# EAGLE design Steering Wheel V2.2 (EAGLE 7.2.0)
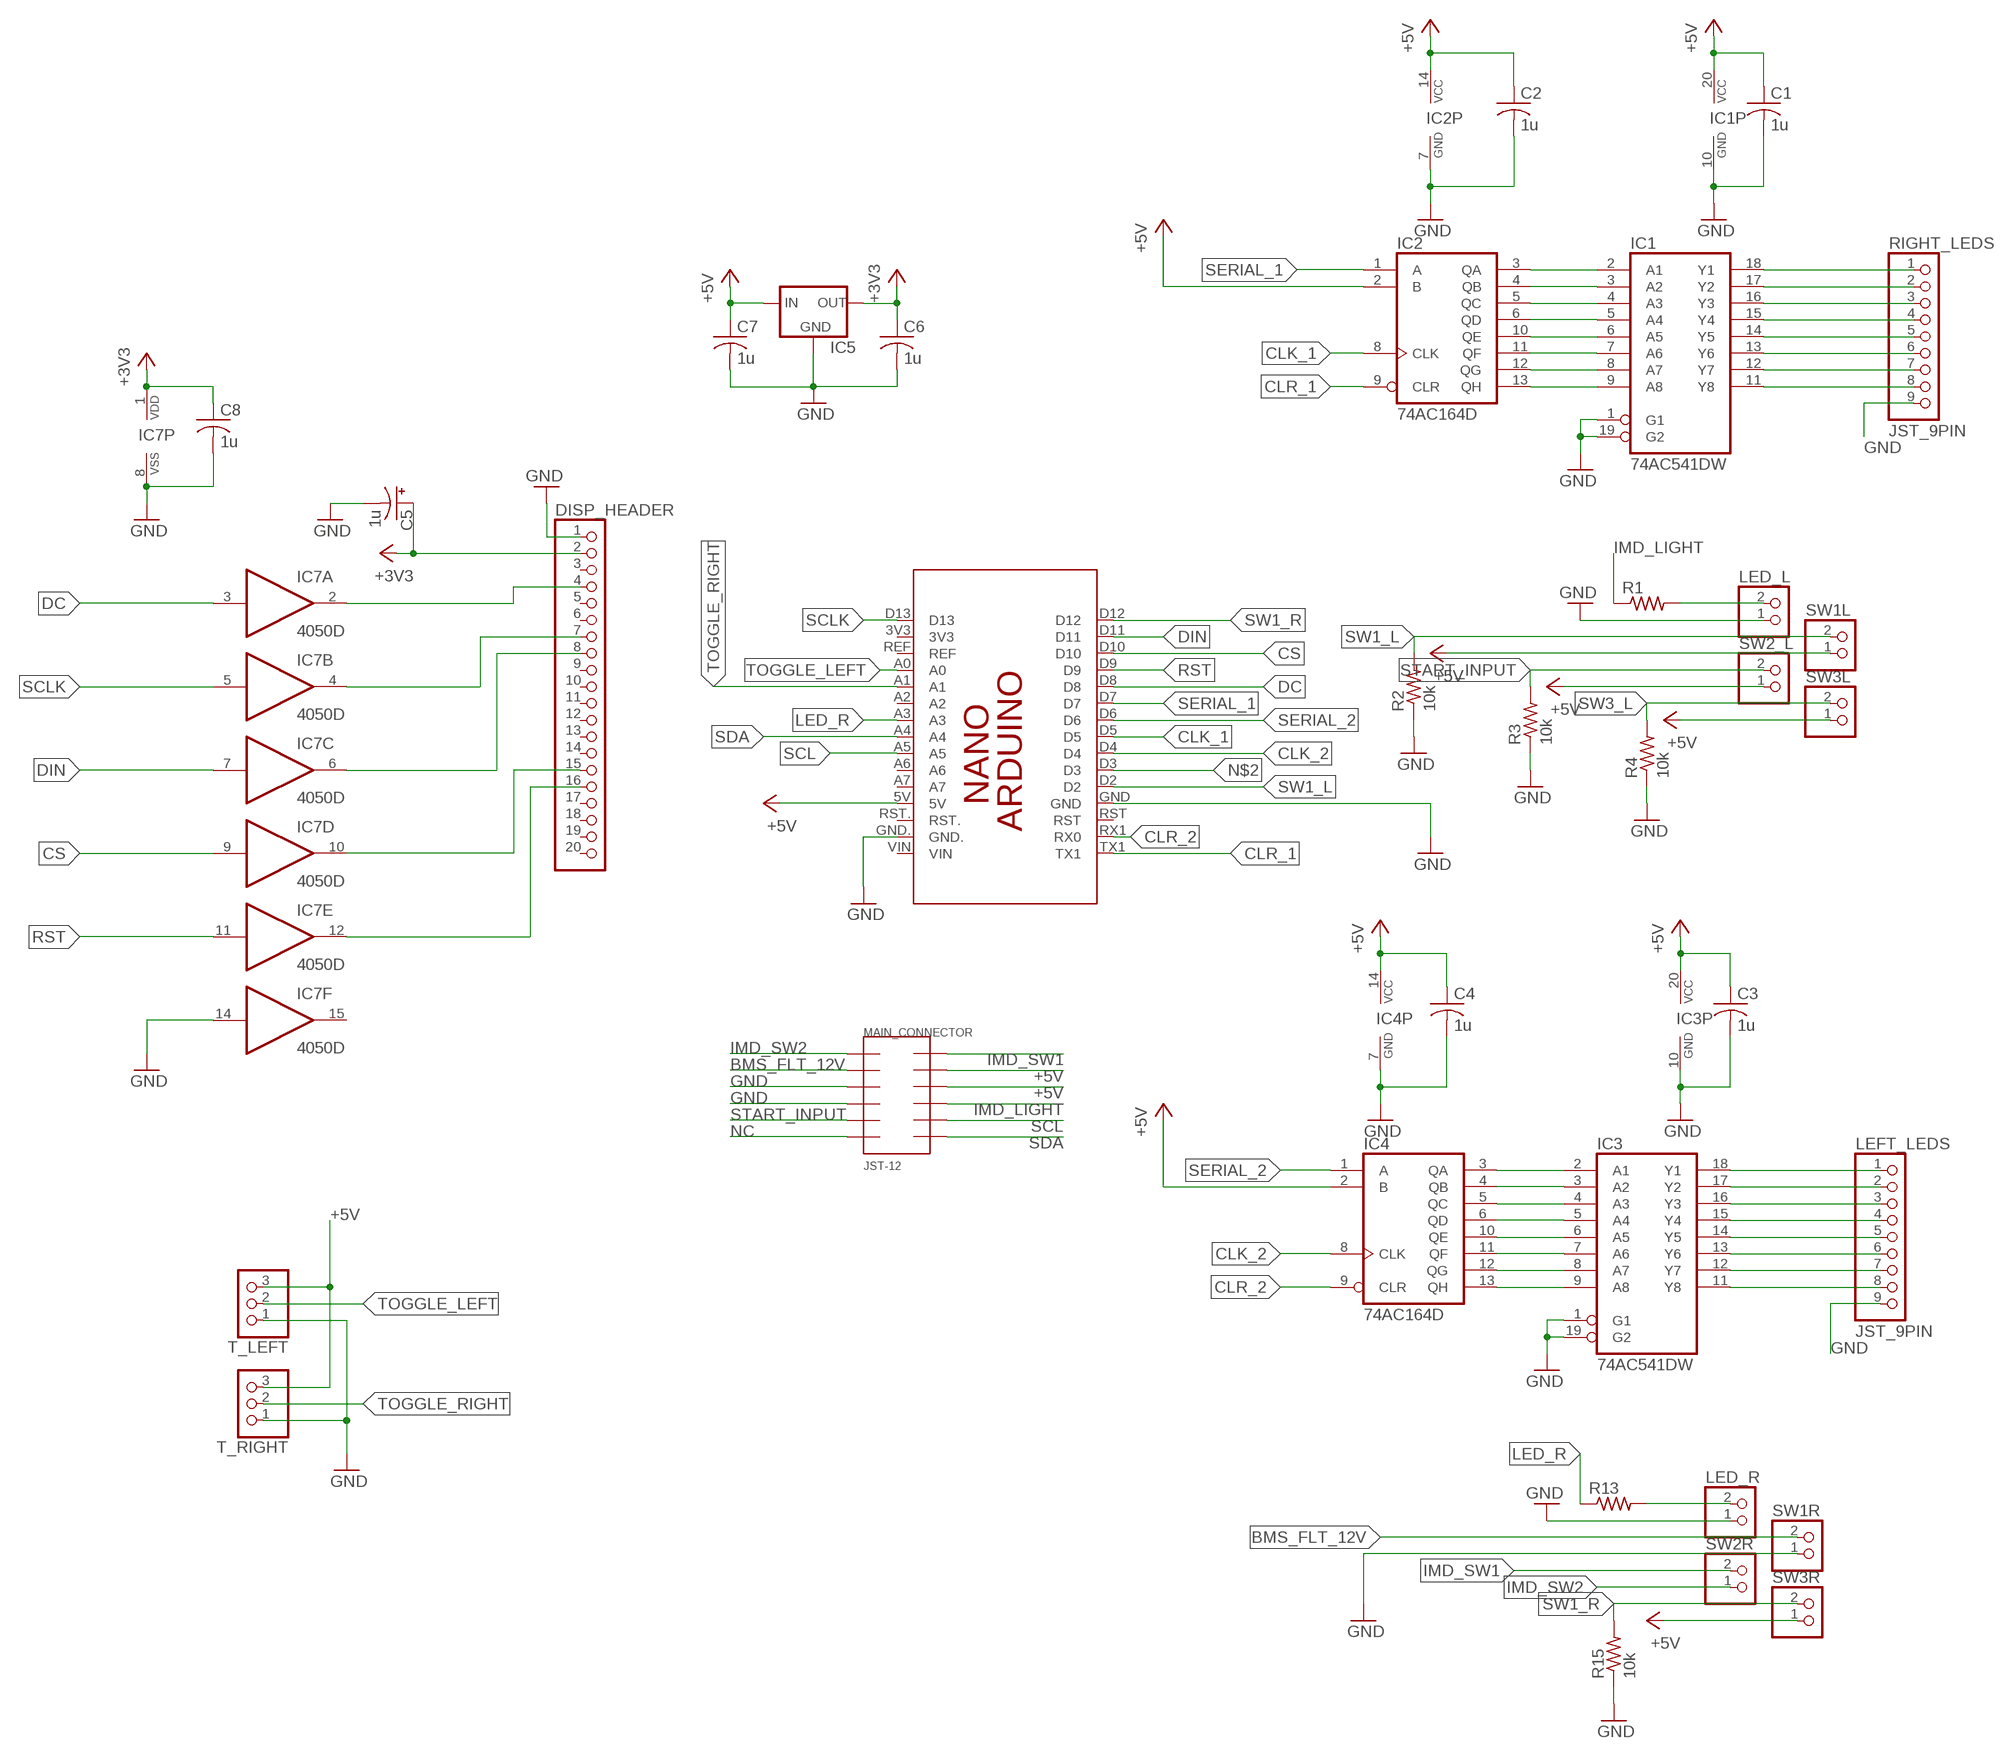
[diagram p0: schematic, sheet 1]

## Parts
C1  1u  C-USC1206  [C1206]
C2  1u  C-USC1206  [C1206]
C3  1u  C-USC1206  [C1206]
C4  1u  C-USC1206  [C1206]
C5  1u  CPOL-USE3.5-8  [E3,5-8]
C6  1u  C-USC1206  [C1206]
C7  1u  C-USC1206  [C1206]
C8  1u  C-USC1206  [C1206]
DISP_HEADER  PINHD-1X20  [1X20]
IC1  74AC541DW  [SO20W]
IC2  74AC164D  [SO14]
IC3  74AC541DW  [SO20W]
IC4  74AC164D  [SO14]
IC5  78XXL  [78XXL]
IC7  4050D  [SO16]
LED_L  JST_2PIN-THM  [JST-PH-2-THM]
LED_R  JST_2PIN-THM  [JST-PH-2-THM]
LEFT_LEDS  JST_9PIN  [JST-PH-9-THM]
MAIN_CONNECTOR  JST-12  [PHD-12]
PCB1  ARDUINO_NANO  [ARDUINO_NANO]
R1  R-US_M1206  [M1206]
R2  10k  R-US_M1206  [M1206]
R3  10k  R-US_M1206  [M1206]
R4  10k  R-US_M1206  [M1206]
R13  R-US_M1206  [M1206]
R15  10k  R-US_M1206  [M1206]
RIGHT_LEDS  JST_9PIN  [JST-PH-9-THM]
SW1L  JST_2PIN-THM  [JST-PH-2-THM]
SW1R  JST_2PIN-THM  [JST-PH-2-THM]
SW2_L  JST_2PIN-THM  [JST-PH-2-THM]
SW2R  JST_2PIN-THM  [JST-PH-2-THM]
SW3L  JST_2PIN-THM  [JST-PH-2-THM]
SW3R  JST_2PIN-THM  [JST-PH-2-THM]
T_LEFT  JST_3PIN  [JST-PH-3-THM]
T_RIGHT  JST_3PIN  [JST-PH-3-THM]

## Nets
+3V3: C5.+ C6.1 C8.1 DISP_HEADER.2 IC5.OUT IC7.1(P:VDD)
+5V: C1.1 C2.1 C3.1 C4.1 C7.1 IC1.20(VCC) IC2.2(B) IC2.14(VCC) IC3.20(VCC) IC4.2(B) IC4.14(VCC) IC5.IN MAIN_CONNECTOR.10 MAIN_CONNECTOR.11 PCB1.5V SW1L.1 SW2_L.1 SW3L.1 SW3R.1 T_LEFT.3 T_RIGHT.3
BMS_FLT_12V: MAIN_CONNECTOR.2 SW1R.2
CLK_1: IC2.8(CLK) PCB1.D5
CLK_2: IC4.8(CLK) PCB1.D4
CLR_1: IC2.9(CLR) PCB1.TX1
CLR_2: IC4.9(CLR) PCB1.RX1(RX0)
CS: IC7.9(D:I) PCB1.D10
DC: IC7.3(A:I) PCB1.D8
DIN: IC7.7(C:I) PCB1.D11
GND: C1.2 C2.2 C3.2 C4.2 C5.- C6.2 C7.2 C8.2 DISP_HEADER.1 IC1.1(G1) IC1.10(GND) IC1.19(G2) IC2.7(GND) IC3.1(G1) IC3.10(GND) IC3.19(G2) IC4.7(GND) IC5.GND IC7.8(P:VSS) IC7.14(F:I) LED_L.1 LED_R.1 LEFT_LEDS.9 MAIN_CONNECTOR.3 MAIN_CONNECTOR.4 PCB1.GND PCB1.GND. R2.1 R3.1 R4.1 R15.1 RIGHT_LEDS.9 SW1R.1 T_LEFT.1 T_RIGHT.1
IMD_LIGHT: MAIN_CONNECTOR.9 R1.1
IMD_SW1: MAIN_CONNECTOR.12 SW2R.2
IMD_SW2: MAIN_CONNECTOR.1 SW2R.1
LED_R: PCB1.A3 R13.1
LED_RIGHT: LED_R.2 R13.2
N$1: LED_L.2 R1.2
N$2: PCB1.D3
N$10: IC1.13(Y6) RIGHT_LEDS.6
N$14: IC1.15(Y4) RIGHT_LEDS.4
N$15: IC1.14(Y5) RIGHT_LEDS.5
N$16: IC1.12(Y7) RIGHT_LEDS.7
N$17: IC1.11(Y8) RIGHT_LEDS.8
N$18: IC1.9(A8) IC2.13(QH)
N$19: IC1.2(A1) IC2.3(QA)
N$20: IC1.3(A2) IC2.4(QB)
N$21: IC1.4(A3) IC2.5(QC)
N$22: IC1.5(A4) IC2.6(QD)
N$23: IC1.6(A5) IC2.10(QE)
N$24: IC1.7(A6) IC2.11(QF)
N$25: IC1.8(A7) IC2.12(QG)
N$35: IC3.18(Y1) LEFT_LEDS.1
N$36: IC3.17(Y2) LEFT_LEDS.2
N$37: IC3.16(Y3) LEFT_LEDS.3
N$38: IC3.15(Y4) LEFT_LEDS.4
N$39: IC3.14(Y5) LEFT_LEDS.5
N$40: IC3.13(Y6) LEFT_LEDS.6
N$41: IC3.12(Y7) LEFT_LEDS.7
N$42: IC3.11(Y8) LEFT_LEDS.8
N$43: IC3.9(A8) IC4.13(QH)
N$44: IC3.2(A1) IC4.3(QA)
N$45: IC3.3(A2) IC4.4(QB)
N$46: IC3.4(A3) IC4.5(QC)
N$47: IC3.5(A4) IC4.6(QD)
N$48: IC3.6(A5) IC4.10(QE)
N$49: IC3.7(A6) IC4.11(QF)
N$50: IC3.8(A7) IC4.12(QG)
N$51: DISP_HEADER.4 IC7.2(A:O)
N$52: DISP_HEADER.16 IC7.12(E:O)
N$53: DISP_HEADER.15 IC7.10(D:O)
N$54: IC1.18(Y1) RIGHT_LEDS.1
N$55: IC1.17(Y2) RIGHT_LEDS.2
N$56: IC1.16(Y3) RIGHT_LEDS.3
N$59: DISP_HEADER.7 IC7.4(B:O)
N$67: DISP_HEADER.8 IC7.6(C:O)
NC: MAIN_CONNECTOR.6
RST: IC7.11(E:I) PCB1.D9
SCL: MAIN_CONNECTOR.8 PCB1.A5
SCLK: IC7.5(B:I) PCB1.D13
SDA: MAIN_CONNECTOR.7 PCB1.A4
SERIAL_1: IC2.1(A) PCB1.D7
SERIAL_2: IC4.1(A) PCB1.D6
START_INPUT: MAIN_CONNECTOR.5 R3.2 SW2_L.2
SW1_L: PCB1.D2 R2.2 SW1L.2
SW1_R: PCB1.D12 R15.2 SW3R.2
SW3_L: R4.2 SW3L.2
TOGGLE_LEFT: PCB1.A0 T_LEFT.2
TOGGLE_RIGHT: PCB1.A1 T_RIGHT.2
Unconnected: DISP_HEADER.3 DISP_HEADER.5 DISP_HEADER.6 DISP_HEADER.9 DISP_HEADER.10 DISP_HEADER.11 DISP_HEADER.12 DISP_HEADER.13 DISP_HEADER.14 DISP_HEADER.17 DISP_HEADER.18 DISP_HEADER.19 DISP_HEADER.20 IC7.15(F:O) PCB1.3V3 PCB1.A2 PCB1.A6 PCB1.A7 PCB1.REF PCB1.RST PCB1.RST. PCB1.VIN

## Library data of the parts
C1-C4 C6-C8 = adafruit:C-US: CAPACITOR, American symbol
C5 = adafruit:CPOL-US: POLARIZED CAPACITOR, American symbol
DISP_HEADER = adafruit:PINHD-1X20: PIN HEADER
IC1 IC3 = 74xx-eu:74*541: Octal BUFFER and LINE DRIVER, 3-state
IC2 IC4 = 74xx-eu:74*164: 8-bit parallel out SHIFT REGISTER
IC5 = v-reg:78XXL: VOLTAGE REGULATOR
IC7 = 40xx:4050: Hex non-inverting BUFFER
LED_L LED_R SW1L SW1R SW2_L SW2R SW3L SW3R = adafruit:JST_2PIN: JST 2-Pin Connectors of various flavors SMT-RA (S2B-PH-SM4) 4UConnector #17311 SMT (B2B-PH-SM4) THM-RA (S2B-PH) THM (B2B-PH)
LEFT_LEDS RIGHT_LEDS = adafruit:JST_9PIN
MAIN_CONNECTOR = JST:JST-12
PCB1 = E14_Arduino_revB:ARDUINO_NANO: Device for representing an Arduino Nano board with a footprint in an EAGLE design. Created by Dave Young for Element14. More EAGLE documentation at: http://www.element14.com/community/community/knode/cadsoft_eagle
R1-R4 R13 R15 = adafruit:R-US_: RESISTOR, American symbol
T_LEFT T_RIGHT = adafruit:JST_3PIN

## Board
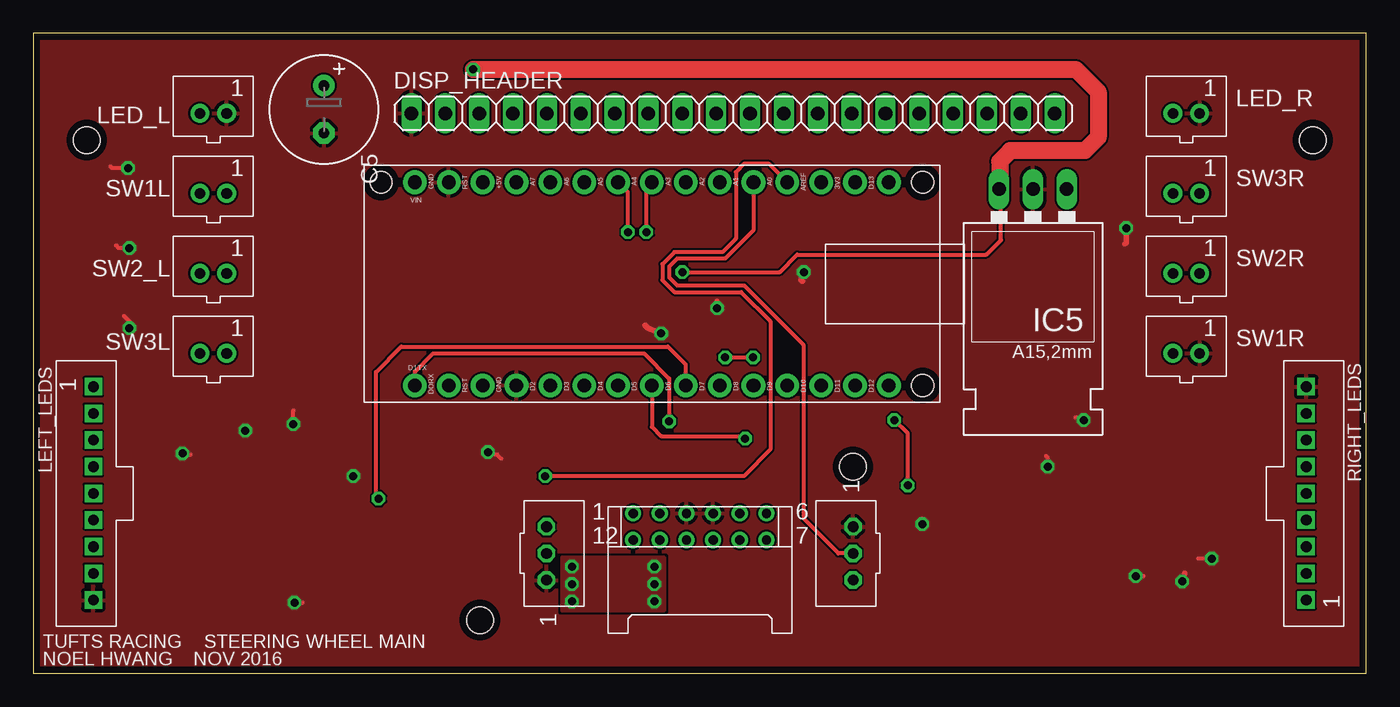
[diagram p1: board, top side]
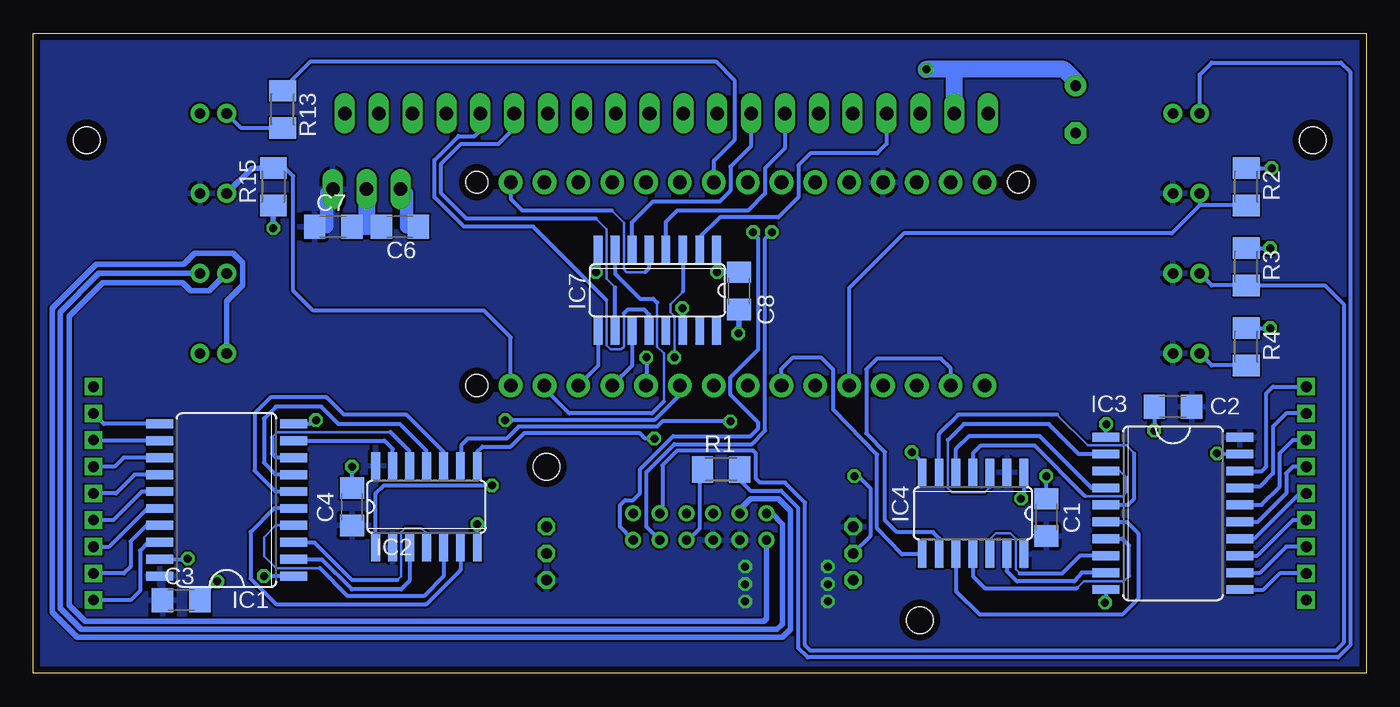
[diagram p2: board, bottom side, seen from below]

Size 100 x 48 mm. Coordinates in mm from the lower left corner, seen from the top.
Outline: 0,0 100,0 100,48 0,48 0,0
Copper layers (1*16): Top 0.035mm / dielectric 1.5mm / Bottom 0.035mm
Design rules: minimum track width 6mil, minimum drill 8mil, track to track 6mil, track to pad 6mil, pad to pad 6mil, via to via 6mil, smd to smd 6mil, copper to edge 20mil, drill to drill 6mil, minimum pad ring 10mil, minimum via ring 8mil, stop-mask expansion 4mil, vias tented up to drill 0mil, thermal gap 10mil
Holes 2 mm at 4,40 96,40 61.5,15.5 33.5,4

### Footprints (pad centres in the part's own frame; a part is rotated, then mirrored left to right if it is on the bottom)
C1206 = smd 1.6 x 1.8: 1 -1.4,0; 2 1.4,0
E3,5-8 = drill 0.813 pad 1.6: + -1.778,0 | drill 0.813 pad 1.6 octagon: - 1.778,0
1X20 = drill 1.016 long: 1 -24.13,0; 2 -21.59,0; 3 -19.05,0; 4 -16.51,0; 5 -13.97,0; 6 -11.43,0; 7 -8.89,0; 8 -6.35,0; 9 -3.81,0; 10 -1.27,0; 11 1.27,0; 12 3.81,0; 13 6.35,0; 14 8.89,0; 15 11.43,0; 16 13.97,0; 17 16.51,0; 18 19.05,0; 19 21.59,0; 20 24.13,0
SO20W = smd 0.66 x 2.032: 1 -5.715,-5.029; 2 -4.445,-5.029; 3 -3.175,-5.029; 4 -1.905,-5.029; 5 -0.635,-5.029; 6 0.635,-5.029; 7 1.905,-5.029; 8 3.175,-5.029; 9 4.445,-5.029; 10 5.715,-5.029; 11 5.715,5.029; 12 4.445,5.029; 13 3.175,5.029; 14 1.905,5.029; 15 0.635,5.029; 16 -0.635,5.029; 17 -1.905,5.029; 18 -3.175,5.029; 19 -4.445,5.029; 20 -5.715,5.029
SO14 = smd 0.66 x 2.032: 1 -3.81,-3.073; 2 -2.54,-3.073; 3 -1.27,-3.073; 4 0,-3.073; 5 1.27,-3.073; 6 2.54,-3.073; 7 3.81,-3.073; 8 3.81,3.073; 9 2.54,3.073; 10 1.27,3.073; 11 0,3.073; 12 -1.27,3.073; 13 -2.54,3.073; 14 -3.81,3.073
78XXL = drill 1.016 long: GND 0,-3.81; IN -2.54,-3.81; OUT 2.54,-3.81
SO16 = smd 0.66 x 2.032: 1 -4.445,-3.073; 2 -3.175,-3.073; 3 -1.905,-3.073; 4 -0.635,-3.073; 5 0.635,-3.073; 6 1.905,-3.073; 7 3.175,-3.073; 8 4.445,-3.073; 9 4.445,3.073; 10 3.175,3.073; 11 1.905,3.073; 12 0.635,3.073; 13 -0.635,3.073; 14 -1.905,3.073; 15 -3.175,3.073; 16 -4.445,3.073
JST-PH-2-THM = drill 0.8 pad 1.422: 1 1,0; 2 -1,0
JST-PH-9-THM = drill 0.8 square: 1 8,0; 2 6,0; 3 4,0; 4 2,0; 5 0,0; 6 -2,0; 7 -4,0; 8 -6,0; 9 -8,0
PHD-12 = drill 0.7: 1 -5,1; 2 -3,1; 3 -1,1; 4 1,1; 5 3,1; 6 5,1; 7 5,-1; 8 3,-1; 9 1,-1; 10 -1,-1; 11 -3,-1; 12 -5,-1
ARDUINO_NANO = drill 1.016 pad 1.778: 3V3 6.35,1.27; 5V 31.75,1.27; A0 11.43,1.27; A1 13.97,1.27; A2 16.51,1.27; A3 19.05,1.27; A4 21.59,1.27; A5 24.13,1.27; A6 26.67,1.27; A7 29.21,1.27; D2 29.21,16.51; D3 26.67,16.51; D4 24.13,16.51; D5 21.59,16.51; D6 19.05,16.51; D7 16.51,16.51; D8 13.97,16.51; D9 11.43,16.51; D10 8.89,16.51; D11 6.35,16.51; D12 3.81,16.51; D13 3.81,1.27; GND 31.75,16.51; GND. 36.83,1.27; REF 8.89,1.27; RST 34.29,16.51; RST. 34.29,1.27; RX1 36.83,16.51; TX1 39.37,16.51; VIN 39.37,1.27 | hole 1.651: 1.27,1.27; 1.27,16.51; 41.91,1.27
M1206 = smd 1.6 x 2: 1 -1.4,0; 2 1.4,0
JST-PH-3-THM = drill 0.8 octagon: 1 2,0; 2 0,0; 3 -2,0

### Placement (x,y rotation side)
C1  24,11.7 90 bottom
C2  14.5,20 180 bottom
C3  88.9,5.5 0 bottom
C4  76.1,12.5 90 bottom
C5  21.8,42.3 270 top
C6  72.5,33.5 180 bottom
C7  77.5,33.5 0 bottom
C8  47.06,28.68 270 bottom
DISP_HEADER  52.5,42 0 top
IC1  85.5,13 90 bottom
IC2  70.5,12.5 0 bottom
IC3  14.5,12 270 bottom
IC4  29.5,12 180 bottom
IC5  75,32.5 180 top
IC7  53.18,28.73 180 bottom
LED_L  13.5,42 0 top
LED_R  86.5,42 0 top
LEFT_LEDS  4.5,13.5 90 top
MAIN_CONNECTOR  50,11 0 top
PCB1  68,38.1 180 top
R1  48.4,15.3 0 bottom
R2  9,36.5 270 bottom
R3  9,30.5 270 bottom
R4  9,24.5 270 bottom
R13  81.3,42.3 270 bottom
R15  82,36.5 90 bottom
RIGHT_LEDS  95.5,13.5 270 top
SW1L  13.5,36 0 top
SW1R  86.5,24 0 top
SW2_L  13.5,30 0 top
SW2R  86.5,30 0 top
SW3L  13.5,24 0 top
SW3R  86.5,36 0 top
T_LEFT  38.5,9 270 top
T_RIGHT  61.5,9 90 top

### Tracks (layer width: path | path; a pad name or v marks a point on that pad's centre or on a via)
+3V3  (via drill 0.6)
  Top 0.3: v48.7,30.1 56,30.1 57.3,31.4 71.5,31.4 72.6,32.5 72.6,36.17 IC5.OUT
  Top 1.27: v33,45.3 78.2,45.3 79.9,43.6 79.9,40.2 78.9,39.2 73.3,39.2 72.5,38.4 72.5,36.35 IC5.OUT
  Bottom 0.3: IC7.1 48.73,30.14 v48.7,30.1 48.68,30.08 C8.1
  Bottom 1.016: C6.1 72,33.5 72,36 72.46,36 IC5.OUT
  Bottom 1.27: C5.+ 21.8,44.4 22.7,45.3 31,45.3 | 31,45.3 v33,45.3 | DISP_HEADER.2 30.91,45.21 31,45.3
+5V  (via drill 0.6)
  Bottom 1.016: C7.1 78,33.5 78,36 77.54,36 IC5.IN
  other vias: 40.4,8 40.4,6.7 46.6,8 46.6,6.7 46.6,5.4 40.4,5.4
  pour Bottom (rank 2): -3.5,50 -3.5,-1 104.5,-1 104.5,50
  pour Top: 39.7,8.7 47.3,8.7 47.3,4.7 39.7,4.7
BMS_FLT_12V
  Bottom 0.406: SW1R.2 85.5,27.9 84.3,29.1 84.3,30.8 85,31.5 87.9,31.5 88.7,30.7 95.3,30.7 98.6,27.4 98.6,4.6 96.7,2.7 43.8,2.7 43.2,3.3 43.2,12.2 44.1,13.1 46.2,13.1 47,12.3 MAIN_CONNECTOR.2
CLK_1  (via drill 0.6)
  Top 0.3: PCB1.D5 46.41,18.49 47.1,17.8 53.2,17.8 v53.4,17.6
  Bottom 0.3: v53.4,17.6 54.1,17.6 54.5,18 63.2,18 64.2,17 66.3,17 66.69,16.61 IC2.8
CLK_2
  Bottom 0.3: IC4.8 34.83,8.93 36.7,10.9 36.7,16.4 40,19.8 40,22.8 40.9,23.7 43,23.7 43.87,22.83 PCB1.D4
CLR_1  (via drill 0.6)
  Top 0.3: PCB1.TX1 28.63,22.63 30,24 45.8,24 47.7,22.1 v47.7,18.9
  Bottom 0.3: v47.7,18.9 52.8,18.9 53.2,18.5 63.6,18.5 64.5,17.6 67.4,17.6 67.9,17.1 67.9,15.63 IC2.9
CLR_2
  Bottom 0.3: IC4.9 32.04,10.14 32.5,10.6 35.2,10.6 36.1,11.5 36.1,16.6 37.5,18 37.5,22.8 36.7,23.6 31.9,23.6 31.17,22.87 PCB1.RX1
CS
  Bottom 0.3: IC7.9 57.62,23.07 PCB1.D10
DC  (via drill 0.6)
  Top 0.3: v51.9,23.7 v54,23.7
  Bottom 0.2: 51.27,28.62 52.2,27.7 52.2,27.1 51.9,26.8 v51.9,23.7
  Bottom 0.3: 54.03,21.07 PCB1.D8 54,21.62 v54,23.7 | IC7.3 51.27,28.62
DIN
  Bottom 0.2: 52.7,20.4 52.7,24 53.2,24.5 53.2,27.8
  Bottom 0.3: 52.7,20.4 53.6,19.5 59.8,19.5 61.65,21.35 PCB1.D11 | IC7.7 56.35,29.95 54.5,28.1 53.5,28.1 53.2,27.8
GND  (via drill 0.6)
  Top 0.3: v19.6,5.3 20.2,5.3 | v34.1,16.6 34.8,16.4 35.1,16.1 | v24,14.8 24.2,14.8 24.4,14.7 | v88.4,8.6 87.4,8.6 | v82.7,7.3 83.3,7.3 | v76.1,15.5 76.1,16.2 76,16.3 | v66.7,11.2 66.7,11.6 | v78.8,19 78.2,19.2 | v11.2,16.5 11.8,16.4 | v15.9,18.2 15.9,18.3 15.8,18.2 | v19.5,18.7 19.5,19.7 | v7.2,25.9 7.2,26.4 6.8,26.8 | v7.2,31.9 6.4,31.9 6.2,32.1 | v7.1,37.9 5.9,37.9 5.8,38
  Top 0.406: v82,33.4 82,32.3 81.9,32.2 | v86.2,6.9 86.4,7.5 | v51.3,27.4 51.3,27.9 | v47.1,25.5 46.1,25.9 45.9,26.1 | v57.8,30.1 57.6,29.5 57.7,29.4
  Bottom 0.3: IC3.10 19.53,5.37 v19.6,5.3 | IC4.7 33.31,15.81 v34.1,16.6 | C1.2 v24,14.8 | IC1.19 88.44,8.55 v88.4,8.6 | IC1.1 82.69,7.29 v82.7,7.3 82.8,7.2 | C4.2 v76.1,15.5 | IC2.7 v66.69,11.19 v66.7,11.2 | IC1.10 79.28,18.71 v78.8,19 | IC3.19 10.96,16.45 v11.2,16.5 | C2.2 v15.9,18.2 | IC3.1 19.53,18.57 v19.5,18.7 | R4.1 v7.2,25.9 | R3.1 v7.2,31.9 | R2.1 v7.1,37.9 | 87.5,5.7 v86.2,6.9
  Bottom 0.406: R15.1 v82,33.4 | C3.2 87.5,5.7 | IC7.14 51.27,27.38 v51.3,27.4 | C8.2 47.06,25.94 v47.1,25.5 | IC7.8 57.62,30.32 v57.8,30.1
  Bottom 1.27: C6.2 75.2,33.5 | 75.2,33.5 C7.2 | IC5.GND 75,33.7 75.2,33.5
  pour Top (rank 2): -4.1,49.4 103.9,49.4 103.9,-3.1 -4.1,-3.1
IMD_LIGHT
  Bottom 0.3: MAIN_CONNECTOR.9 50.9,10 50,10.9 50,15.1 R1.1
IMD_SW1
  Bottom 0.406: MAIN_CONNECTOR.12 45,4.1 45.2,3.9 96.1,3.9 97.3,5.1 97.3,26.8 94.8,29.3 88.8,29.3 88.2,28.7 86.8,28.7 SW2R.2
IMD_SW2
  Bottom 0.406: MAIN_CONNECTOR.1 44.6,12 43.8,11.2 43.8,3.7 44.2,3.3 96.4,3.3 98,4.9 98,27.1 95.1,30 SW2R.1
LED_R
  Bottom 0.3: R13.1 81.3,43.8 79.2,45.9 48.8,45.9 47.4,44.5 47.4,40 48.95,38.45 PCB1.A3
LED_RIGHT
  Bottom 0.3: R13.2 84.4,40.9 LED_R.2
N$1
  Bottom 0.3: LED_L.2 12.5,44.9 11.6,45.8 1.9,45.8 1.2,45.1 1.2,2.1 2.1,1.2 41.9,1.2 42.6,1.9 42.6,12.4 43.9,13.7 46.2,13.7 47,14.5 R1.2
N$10
  Bottom 0.3: IC1.13 93.22,16.18 93.9,15.5 RIGHT_LEDS.6
N$14
  Bottom 0.3: IC1.15 91.86,13.63 94,11.5 RIGHT_LEDS.4
N$15
  Bottom 0.3: IC1.14 92.39,14.9 93.8,13.5 RIGHT_LEDS.5
N$16
  Bottom 0.3: IC1.12 95.44,17.45 RIGHT_LEDS.7
N$17
  Bottom 0.3: IC1.11 94.72,18.71 RIGHT_LEDS.8
N$18
  Bottom 0.3: IC2.13 73.04,16.84 73.64,17.45 IC1.9
N$19
  Bottom 0.3: IC2.3 71.77,6.93 72.4,6.3 76.1,6.3 78.36,8.55 IC1.2
N$20
  Bottom 0.2: 70.5,10.5 70.9,10.9 72.1,10.9 72.4,10.6 72.4,7.3 72.7,7
  Bottom 0.3: IC2.4 70.5,10.5 | 72.7,7 76.1,7 78.92,9.82 IC1.3
N$21
  Bottom 0.2: 78.5,7.9 81.8,7.9 82.7,8.8 82.7,10.2 81.81,11.1 IC1.4
  Bottom 0.3: IC2.5 69.23,7.27 70.7,5.8 76.4,5.8 78.5,7.9
N$22
  Bottom 0.3: IC1.5 81.94,12.37 83.7,10.6 83.7,7.1 81.8,5.2 70.5,5.2 67.96,7.74 IC2.6
N$23
  Bottom 0.3: IC2.10 69.23,16.63 72,19.4 76.7,19.4 78,20.7 82.2,20.7 83.4,19.5 83.4,15.2 81.83,13.63 IC1.6
N$24
  Bottom 0.3: IC2.11 70.5,16.7 72.5,18.7 77.1,18.7 78.4,20 81.8,20 82.7,19.1 82.7,15.8 81.81,14.9 IC1.7
N$25
  Bottom 0.2: 73.2,18.1 81.7,18.1 82.1,17.7
  Bottom 0.3: IC2.12 71.77,16.67 73.2,18.1 | 82.1,17.7 82.1,16.5 81.78,16.18 IC1.8
N$35
  Bottom 0.3: IC3.18 7.83,15.18 7.5,15.5 7.5,21 7,21.5 LEFT_LEDS.1
N$36
  Bottom 0.3: LEFT_LEDS.2 6,19.5 7,18.5 7,15 8,14 9.38,14 IC3.17
N$37
  Bottom 0.3: LEFT_LEDS.3 5.5,17.5 6.5,16.5 6.5,14 7.87,12.63 IC3.16
N$38
  Bottom 0.3: LEFT_LEDS.4 5.5,15.5 6,15 6,13.5 8.13,11.37 IC3.15
N$39
  Bottom 0.3: LEFT_LEDS.5 5,13.5 8.4,10.1 IC3.14
N$40
  Bottom 0.3: LEFT_LEDS.6 5.5,11.5 8.18,8.82 IC3.13
N$41
  Bottom 0.3: LEFT_LEDS.7 6,9.5 7.95,7.55 IC3.12
N$42
  Bottom 0.3: LEFT_LEDS.8 6.5,7.5 7.71,6.29 IC3.11
N$43
  Bottom 0.3: IC3.9 21.34,7.55 21.9,6.9 26.2,6.9 26.96,7.66 IC4.13
N$44
  Bottom 0.2: 28.23,13.97 28.6,13.6 31.1,13.6 31.4,13.9 31.4,17.5
  Bottom 0.3: IC4.3 28.23,13.97 | IC3.2 21.55,16.45 23.8,18.7 30.2,18.7 31.4,17.5
N$45
  Bottom 0.2: IC3.3 18.48,15.18 18,14.7 18,13.6 18.3,13.3 21.1,13.3
  Bottom 0.3: 21.1,13.3 24.9,17.1 28.9,17.1 29.5,16.5 IC4.4
N$46
  Bottom 0.3: IC3.4 20.61,13.9 24.5,17.8 29.8,17.8 30.77,16.83 IC4.5
N$47
  Bottom 0.2: 17.4,16.5 18,17.1 20.9,17.1 23.2,19.4
  Bottom 0.3: IC3.5 17.86,12.63 17.4,13.1 17.4,16.5 | IC4.6 32.04,17.96 30.6,19.4 23.2,19.4
N$48
  Bottom 0.3: IC3.6 17.96,11.37 17.1,10.5 17.1,5.6 18.3,4.4 29,4.4 30.77,6.17 IC4.10
N$49
  Bottom 0.2: 21.7,6.4 21.2,6.9 18.2,6.9 17.8,7.3
  Bottom 0.3: IC4.11 29.5,7.3 28.6,6.4 21.7,6.4 | 17.8,7.3 17.8,9.6 18.3,10.1 IC3.7
N$50
  Bottom 0.2: IC4.12 28.23,10.07 27.8,10.5 26.7,10.5 26.3,10.1 26.3,7.8 26,7.5
  Bottom 0.3: 26,7.5 22.8,7.5 21.48,8.82 IC3.8
N$51
  Bottom 0.3: DISP_HEADER.4 35.99,39.71 36.7,39 41.7,39 42.6,38.1 42.6,35.7 44.1,34.2 48.5,34.2 50.01,32.7 IC7.2
N$52
  Bottom 0.2: 57,28 57,24.6 56.7,24.3 55.9,24.3 55.7,24.5 55.7,27
  Bottom 0.3: 55.7,27 55.4,27.3 54.2,27.3 53.8,26.9 53.81,26.89 IC7.12 | 57,28 62.5,33.5 67.7,33.5 69.9,35.7 69.9,38.5 68.1,40.3 66.9,40.3 66.5,40.7 66.5,41.97 DISP_HEADER.16
N$53
  Bottom 0.2: 57.8,34.1 57,33.3 57,29.6 56.35,28.95
  Bottom 0.3: IC7.10 56.35,28.95 | 57.8,34.1 67.5,34.1 69.4,36 69.4,38.2 67.9,39.7 65.1,39.7 63.93,40.87 DISP_HEADER.15
N$54
  Bottom 0.3: IC1.18 91.38,9.82 92,9.2 92,6.2 92.7,5.5 RIGHT_LEDS.1
N$55
  Bottom 0.3: IC1.17 91.5,11.1 92.7,9.9 92.7,8 93.2,7.5 RIGHT_LEDS.2
N$56
  Bottom 0.3: IC1.16 91.44,12.37 94.3,9.5 RIGHT_LEDS.3
N$59
  Bottom 0.3: DISP_HEADER.7 43.61,39.39 45.1,37.9 45.1,36 46.4,34.7 51.7,34.7 52.55,33.85 IC7.4
N$67
  Bottom 0.3: DISP_HEADER.8 46.15,39.55 47.7,38 47.7,36.2 48.5,35.4 53.5,35.4 55.09,33.81 IC7.6
RST
  Bottom 0.3: IC7.11 55.09,23.07 PCB1.D9
SCL  (via drill 0.6)
  Top 0.3: v44.6,33.1 44.6,36.1 PCB1.A5
  Bottom 0.3: MAIN_CONNECTOR.8 54,11 54,15.1 51.9,17.2 46.1,17.2 45.1,18.2 45.1,32.6 v44.6,33.1
SCLK
  Bottom 0.2: 54.1,30.1 55.5,30.1 55.7,30.3 55.7,33.8 56.6,34.7
  Bottom 0.3: IC7.5 53.81,30.39 54.1,30.1 | 56.6,34.7 63.3,34.7 64.19,35.59 PCB1.D13
SDA  (via drill 0.6)
  Top 0.3: v46,33.1 46,36.42 PCB1.A4
  Bottom 0.3: MAIN_CONNECTOR.7 56,11 56,12.6 55.6,13 55,13 54.5,13.5 54.5,15.3 52,17.8 46.2,17.8 45.6,18.4 45.6,18.8 47.7,20.9 47.7,22.2 45.6,24.3 45.6,32.6 v46,33.1
SERIAL_1  (via drill 0.6)
  Top 0.3: v65.6,14.1 65.6,18 v64.6,19
  Bottom 0.3: IC2.1 74.31,13.49 73.7,14.1 v65.6,14.1 | PCB1.D7 51.49,20.91 53.4,19 v64.6,19
SERIAL_2  (via drill 0.6)
  Top 0.3: v25.9,13.1 25.7,13.3 25.7,22.6 27.6,24.5 47.6,24.5 48.95,23.15 PCB1.D6
  Bottom 0.3: IC4.1 25.69,13.31 v25.9,13.1
START_INPUT
  Bottom 0.3: SW2_L.2 11.6,29.1 R3.2 3.1,29.1 1.7,27.7 1.7,2.3 2.3,1.7 41.7,1.7 42.1,2.1 42.1,12.8 43.6,14.3 45.5,14.3 45.8,14.6 45.8,16.5 46,16.7 51.7,16.7 52.8,15.6 52.8,12.2 MAIN_CONNECTOR.5
SW1_L
  Bottom 0.3: R2.2 12.5,35.1 | SW1L.2 12.5,35.1 | 12.5,35.1 14.6,33 34.7,33 38.8,28.9 PCB1.D2
SW1_R
  Bottom 0.3: PCB1.D12 64.19,25.19 66.2,27.2 79,27.2 80.5,28.7 80.5,37.3 81.1,37.9 R15.2
  Bottom 0.406: R15.2 83.6,37.9 SW3R.2
SW3_L
  Bottom 0.3: R4.2 11.6,23.1 SW3L.2
TOGGLE_LEFT  (via drill 0.6)
  Top 0.3: PCB1.A0 55.2,38.2 53.3,38.2 52.7,37.6 52.7,32.6 51.7,31.6 48.1,31.6 47.2,30.7 47.2,29.5 48.1,28.6 53.1,28.6 55.3,26.4 55.3,16.8 53.3,14.8 v38.4,14.8
  Bottom 0.3: v38.4,14.8 38.1,14.8 37.2,13.9 37.2,10.3 T_LEFT.2
TOGGLE_RIGHT
  Top 0.3: PCB1.A1 54.03,33.23 51.9,31.1 48.3,31.1 47.7,30.5 47.7,29.7 48.3,29.1 53.3,29.1 57.8,24.6 57.8,11.6 60.4,9 T_RIGHT.2

### Text on the board
tNames: TUFTS RACING | STEERING WHEEL MAIN | NOEL HWANG | NOV 2016